# EasyEDA Pro project ProPrj_智能视觉集成板-V1.1.epro, schematic Schematic3
Board Name: 灰度传感器; Create Date: 2025-04-19; Page Name: P1; Project Name: 009-智能视觉集成板-V1.1; Schematic Name: Schematic3; Update Date: 2025-04-19; Company: 嘉立创EDA; Page Size: A4; Version: V1.0
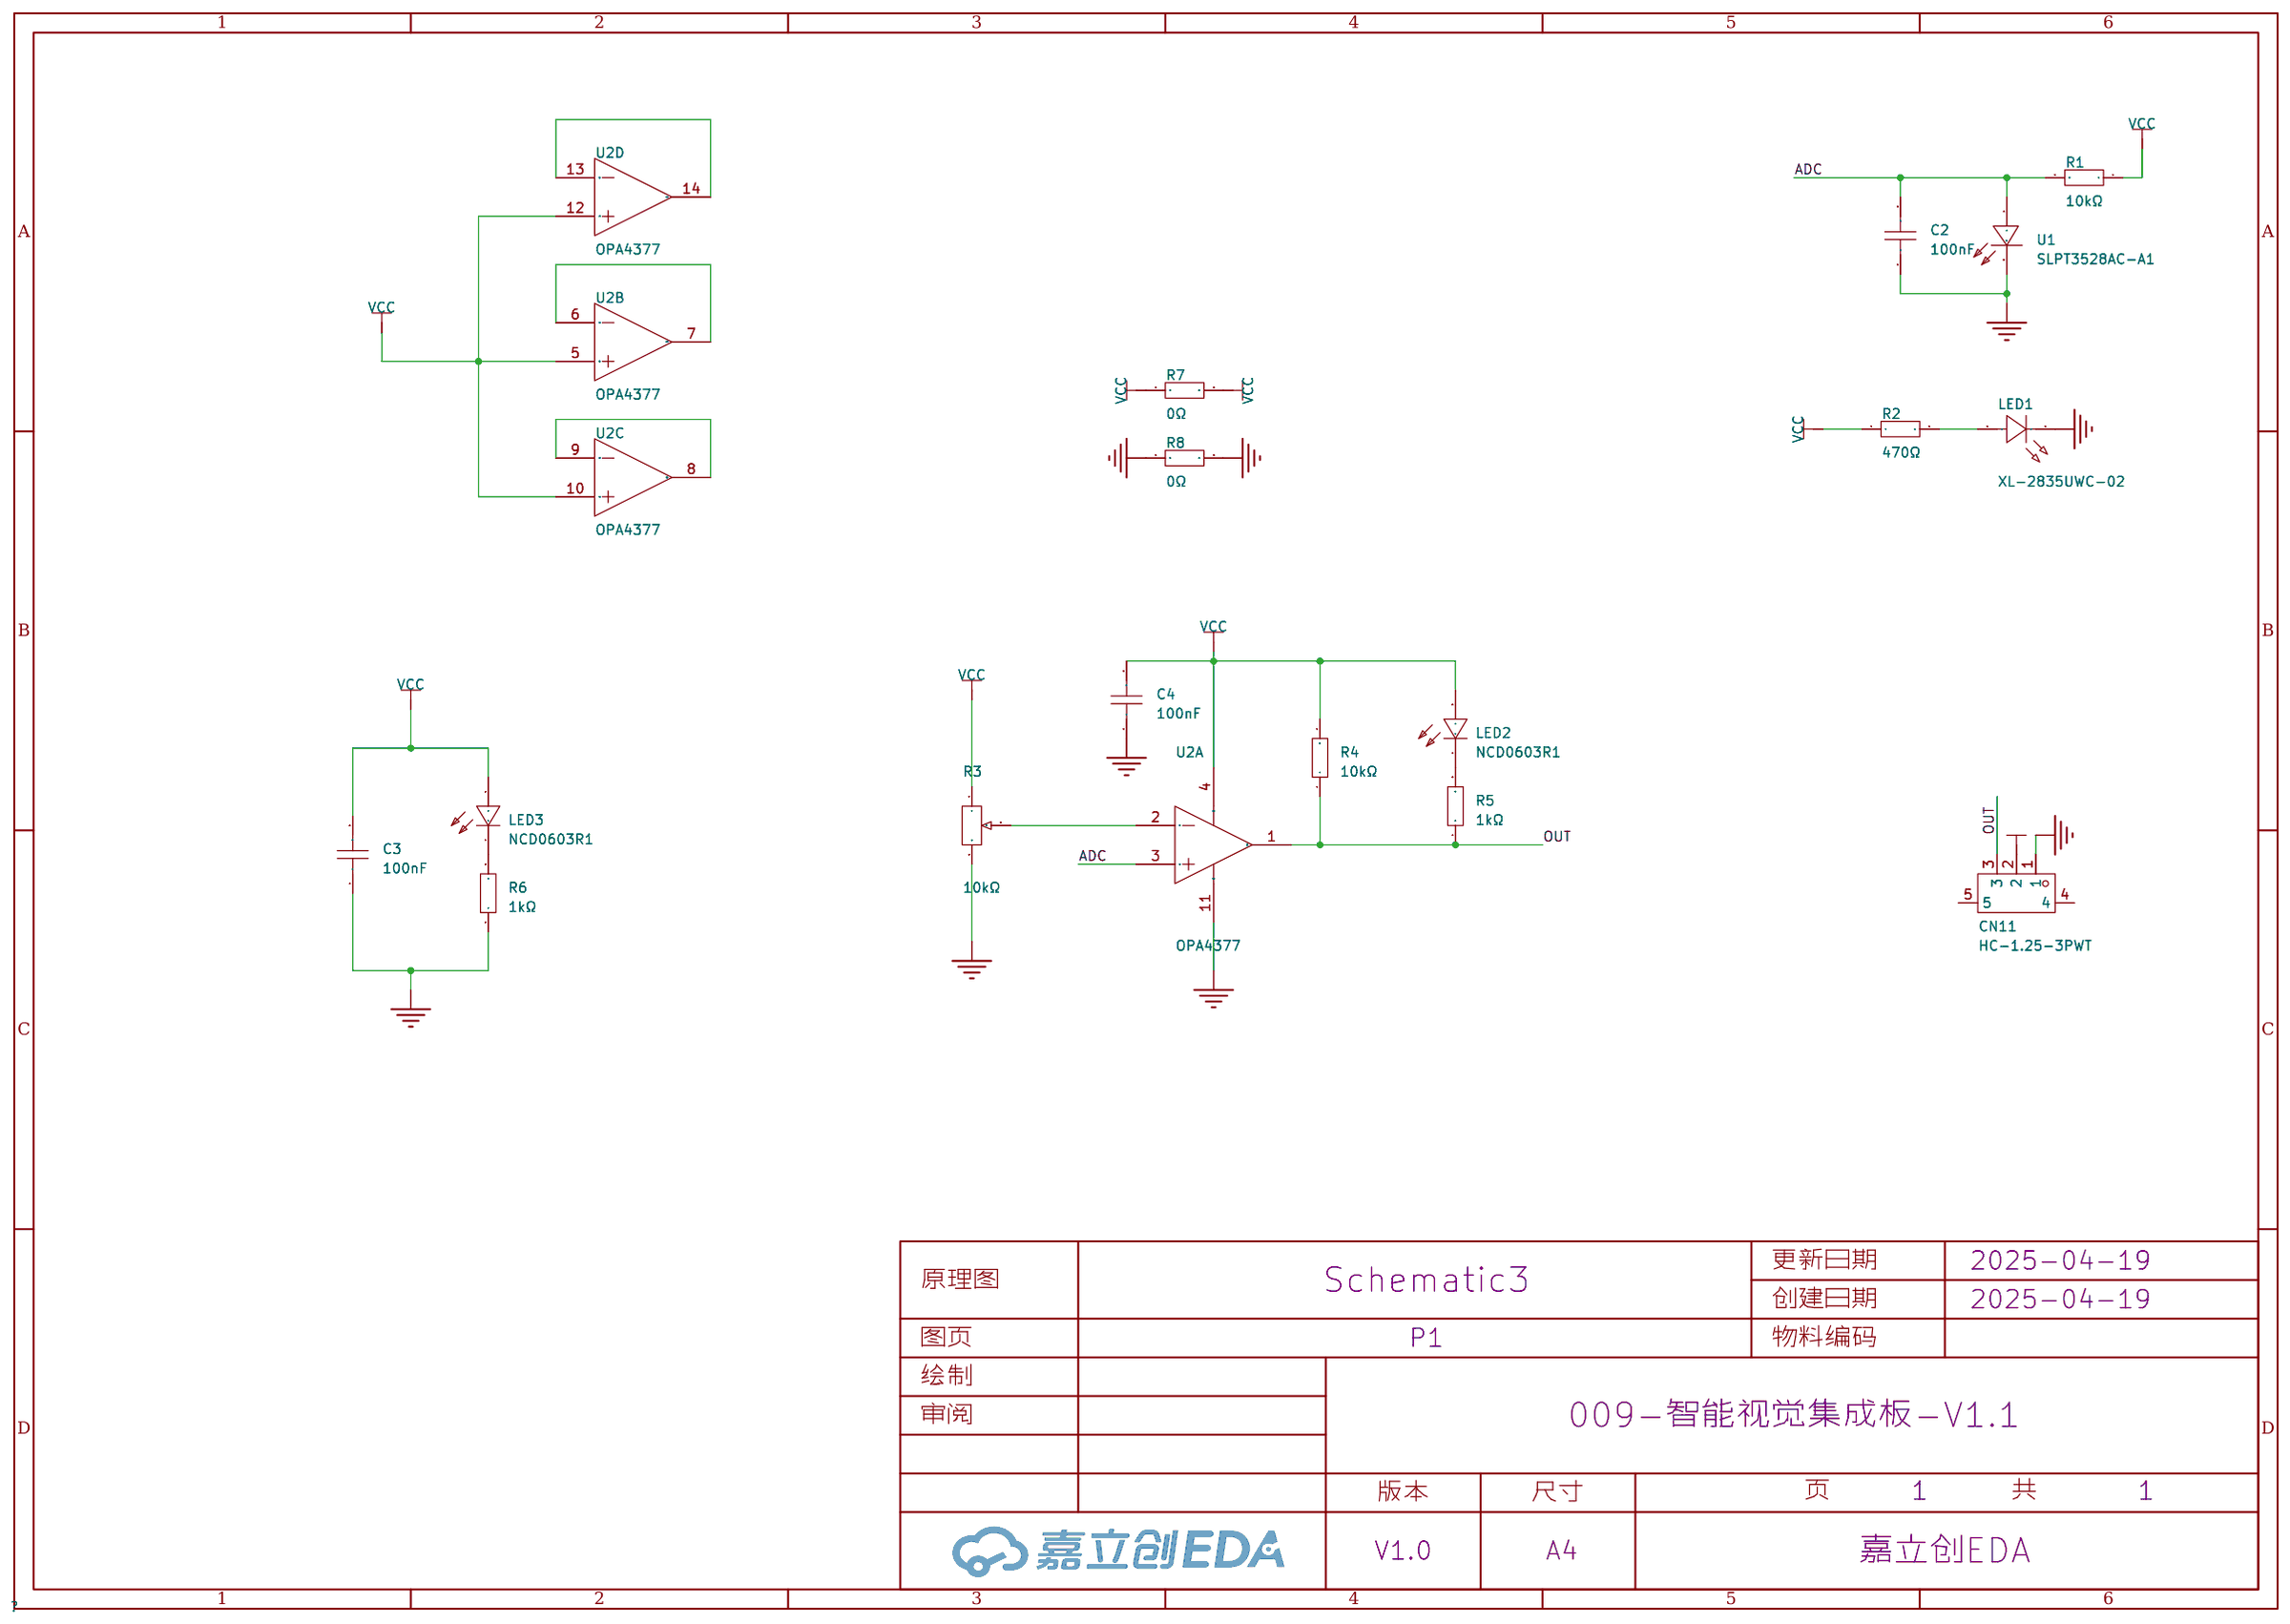
[diagram p8: schematic sheet]

## Parts
C2  100nF  [C0603]
C3  100nF  [C0603]
C4  100nF  [C0603]
CN11  HC-1.25-3PWT  [CONN-SMD_HC-1.25-3PWT]
LED1  XL-2835UWC-02  [LED-SMD_L3.5-W2.8-RD_1.25T-2PWT]
LED2  NCD0603R1  [LED0603-RD_RED]
LED3  NCD0603R1  [LED0603-RD_RED]
R1  10kΩ  [R0603]
R2  470Ω  [R0603]
R3  10kΩ  [RES-ADJ-TH_3P-L5.0-W4.5-P2.35-BR]
R4  10kΩ  [R0603]
R5  1kΩ  [R0603]
R6  1kΩ  [R0603]
R7  0Ω  [R0603]
R8  0Ω  [R0603]
U1  SLPT3528AC-A1  [OPTO-SMD_L3.5-W2.8-FD]
U2  OPA4377  [TSSOP-14_L5.0-W4.4-P0.65-LS6.4-BL]  (sections 1,2,3,4)

## Library data of the parts
C2-C4 = CGA0603X7R104K500JT: 容值:100nF;精度:±10%;额定电压:50V;材质(温度系数):X7R;; LCSC Part Name: 100nF ±10% 50V; Supplier Part: C6119867; Manufacturer: HRE(芯声); Supplier Footprint: 0603; JLCPCB Part Class: 扩展库; Supplier: LCSC; Tolerance: ±10%; Voltage Rated: 50V; Temperature Coefficient: X7R
CN11 = HC-1.25-3PWT: 插针结构:1x3P;间距:1.25mm;安装方式:卧贴;参考系列:PicoBlade(MX 1.25);总PIN数:3P;排数:1;每排PIN数:3;行距:-;额定电流:1A;触头材质:黄铜;触头镀层:锡;工作温度范围:-40℃~+105℃;; LCSC Part Name: 1x3P 间距:1.25mm 卧贴 系列:PicoBlade(MX 1.25); Supplier Part: C2845380; Manufacturer: HCTL(华灿天禄); Supplier Footprint: SMD,P=1.25mm,卧贴; JLCPCB Part Class: 扩展库; Datasheet: https://atta.szlcsc.com/upload/public/pdf/source/20240930/9508A8292CCC87B0C29E3A028D56E30A.pdf; Supplier: LCSC; Pins Structure: 1x3P; Pitch: 1.25mm; Mounting Style: 卧贴; Reference Series: PicoBlade(MX 1.25); Number of Pins: 3P; Number of Rows: 1; Number of PINs Per Row: 3; Current Rating (Max): 1A; Contact Material: 黄铜; Contact Plating: 锡; Operating Temperature Range: -40℃~+105℃; Rated Voltage (Max): 125V; Plastic Material: LCP; Flame Retardant Rating: UL94V-0; Supplementary Features: 辅助焊脚; Z-Height of the Board: 3.57mm; X-Length of Bottom Edge on Board (Spacing Line): 8.8mm; Y-Width of Bottom Edge on Board: 5.25mm
LED1 = XL-2835UWC-02: 灯头类型:-;发光颜色:白色;正向电压(VF):3.4V;功率:200mW;正向电流:60mA;主波长:-;二极管配置:-;透镜颜色:黄色透镜;色温:6000K~7500K;发光强度:-;发光角度:120°;载带方式:正贴;工作温度:-20℃~+85℃;; Supplier Part: C2843876; Manufacturer: XINGLIGHT(成兴光); Supplier Footprint: SMD2835; JLCPCB Part Class: 扩展库; Datasheet: https://atta.szlcsc.com/upload/public/pdf/source/20240218/E8C64919BE50F1709DD6667A3F2A851D.pdf; Supplier: LCSC; Emitted Color: 白色; Forward Voltage (VF): 3.4V; Power Dissipation: 200mW; Forward Current: 60mA; Lens Color: 黄色透镜; Color Temperature: 6000K~7500K; Viewing Angle: 120°; Mounting Sytle: 正贴; Operating Temperature: -20℃~+85℃
LED2 LED3 = NCD0603R1_C84263: 灯头类型:-;发光颜色:红色;正向电压(VF):1.6V~2.6V;功率:65mW;正向电流:20mA;主波长:615nm~630nm;二极管配置:独立二极管;透镜颜色:无色透明透镜;色温:-;发光强度:80mcd~220mcd;发光角度:130°;载带方式:-;工作温度:-30℃~+85℃;; Supplier Part: C84263; Manufacturer: 国星光电; Supplier Footprint: 0603; JLCPCB Part Class: 扩展库; Datasheet: https://atta.szlcsc.com/upload/public/pdf/source/20200820/C84263_DABC6A75E58F576973B407FDBA283D60.pdf; Supplier: LCSC; Emitted Color: 红色; Forward Voltage (VF): 1.6V~2.6V; Power Dissipation: 65mW; Forward Current: 20mA; Dominant Wavelength: 615nm~630nm; Diode Configuration: 独立二极管; Lens Color: 无色透明透镜; Luminous Intensity: 80mcd~220mcd; Viewing Angle: 130°; Operating Temperature: -30℃~+85℃
R1 R4-R6 = 0603WAF1002T5E: 电阻类型:厚膜电阻;阻值:10kΩ;精度:±1%;功率:100mW;最大工作电压:75V;温度系数:±100ppm/℃;; LCSC Part Name: 厚膜电阻 10kΩ ±1% 100mW; Supplier Part: C25804; Manufacturer: UNI-ROYAL(厚声); Supplier Footprint: 0603; JLCPCB Part Class: 基础库; Datasheet: https://atta.szlcsc.com/upload/public/pdf/source/20200306/C422600_1E6D84923E4A46A82E41ADD87F860B5C.pdf; Supplier: LCSC; Type: 厚膜电阻; Tolerance: ±1%; Power(Watts): 100mW; Overload Voltage (Max): 75V; Temperature Coefficient: ±100ppm/℃; Operating Temperature Range: -55℃~+155℃
R2 = 0603WAF4700T5E: 电阻类型:厚膜电阻;阻值:470Ω;精度:±1%;功率:100mW;最大工作电压:75V;温度系数:±100ppm/℃;; LCSC Part Name: 470Ω ±1% 100mW 厚膜电阻; Supplier Part: C23179; Manufacturer: UNI-ROYAL(厚声); Supplier Footprint: 0603; JLCPCB Part Class: 基础库; Datasheet: https://atta.szlcsc.com/upload/public/pdf/source/20200306/C422600_1E6D84923E4A46A82E41ADD87F860B5C.pdf; Supplier: LCSC; Type: 厚膜电阻; Tolerance: ±1%; Power(Watts): 100mW; Overload Voltage (Max): 75V; Temperature Coefficient: ±100ppm/℃; Operating Temperature Range: -55℃~+155℃
R3 = ST-4EA 10K ohm (103): 阻值:10kΩ;精度:±20%;; LCSC Part Name: 10kΩ ±20%; Supplier Part: C132879; Manufacturer: NIDEC(尼得科); Supplier Footprint: SMD; JLCPCB Part Class: 扩展库; Datasheet: https://atta.szlcsc.com/upload/public/pdf/source/20170930/C132883_1506736317962997236.pdf; Supplier: LCSC; Tolerance: ±20%
R7 R8 = 0603WAF0000T5E: 电阻类型:厚膜电阻;阻值:0Ω;精度:±1%;功率:100mW;最大工作电压:75V;; LCSC Part Name: 0Ω ±1% 100mW 厚膜电阻; Supplier Part: C21189; Manufacturer: UNI-ROYAL(厚声); Supplier Footprint: 0603; JLCPCB Part Class: 基础库; Datasheet: https://atta.szlcsc.com/upload/public/pdf/source/20200306/C422600_1E6D84923E4A46A82E41ADD87F860B5C.pdf; Supplier: LCSC; Type: 厚膜电阻; Tolerance: ±1%; Power(Watts): 100mW; Overload Voltage (Max): 75V; Operating Temperature Range: -55℃~+155℃
U1 = SLPT3528AC-A1: Supplier Part: C5355499; Manufacturer: Slkor(萨科微); Supplier Footprint: SMD,2.8x3.5mm; JLCPCB Part Class: 扩展库; Datasheet: https://atta.szlcsc.com/upload/public/pdf/source/20230206/6B9F6E8C4A34F9966377DCB1EF80C72B.pdf; Supplier: LCSC; Operating Temperature: -30℃~+85℃
U2 = OPA4377: 增益带宽积(GBP):5.5MHz;压摆率(SR):2V/us;; LCSC Part Name: OPA4377(TOKMAS); Supplier Part: C7470936; Manufacturer: Tokmas(托克马斯); Supplier Footprint: TSSOP-14; JLCPCB Part Class: 扩展库; Datasheet: https://atta.szlcsc.com/upload/public/pdf/source/20230802/9E83D4BA48932C3E6B90404DEE148918.pdf; Supplier: LCSC; Gain Bandwidth Product(GBP): 5.5MHz; Slew Rate(SR): 2V/us

## Nets
GND: C2.1 C3.1 C4.1 CN11.1 LED1.1(K) R3.3 R6.1 R8.1 R8.2 U1.2 U2.11(VSS)
VCC: C3.2 C4.2 CN11.2 LED2.2(A) LED3.2(A) R1.1 R2.1 R3.1 R4.2 R7.1 R7.2 U2.4(VDD) U2.5(INB+) U2.10(INC+) U2.12(IND+)
ADC: C2.2 R1.2 U1.1 U2.3(INA+)
OUT: CN11.3 R4.1 R5.1 U2.1(OUTA)
$1N568: LED1.2(A) R2.2
$1N1173: R3.2 U2.2(INA–)
$1N1514: LED2.1(K) R5.2
$1N1929: LED3.1(K) R6.2
$1N2309: U2.6(INB-) U2.7(OUTB)
$1N2318: U2.13(IND-) U2.14(OUTD)
$1N2328: U2.8(OUTC) U2.9(INC-)

Not connected (* = marked no-connect by the designer): CN11 4 5
